# EAGLE design supply (EAGLE 5.01)
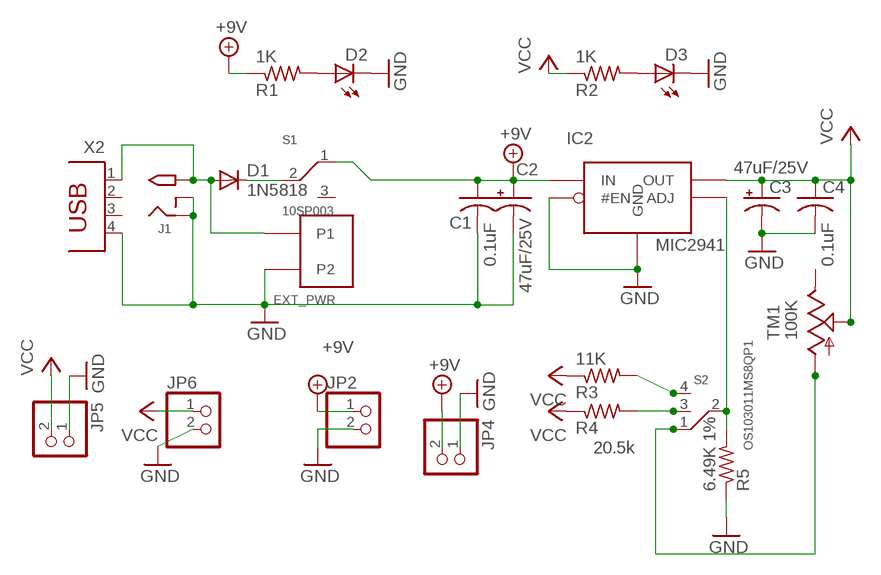
[diagram p0: schematic, sheet 1]

## Parts
C1  0.1uF  C-US025-025X050  [C025-025X050]
C2  47uF/25V  CPOL-USE2.5-6  [E2,5-6]
C3  47uF/25V  CPOL-USE2.5-6  [E2,5-6]
C4  0.1uF  C-US025-025X050  [C025-025X050]
D1  1N5818  1N4004  [DO41-10]
D2  LED3MM  [LED3MM]
D3  LED3MM  [LED3MM]
EXT_PWR  PINHEAD  [TERMBLOCK508]
IC2  MIC2941  [TO220-5]
J1  2.1MMJACK  [PJ-102A]
JP2  PINHD-1X2  [1X02]
JP4  PINHD-1X2  [1X02]
JP5  PINHD-1X2  [1X02]
JP6  PINHD-1X2  [1X02]
R1  1K  R-US_0207/5V  [0207/5V]
R2  1K  R-US_0207/5V  [0207/5V]
R3  11K  R-US_0207/5V  [0207/5V]
R4  20.5k  R-US_0207/5V  [0207/5V]
R5  6.49K 1%  R-US_0207/5V  [0207/5V]
S1  10SP003  [10SP003]
S2  OS103011MS8QP1  [OS103011MS8QP1]
TM1  100K  TRIM  [6MM]
X2  PN61729  [PN61729]

## Nets
+9V: C1.1 C2.+ IC2.4(IN) JP2.1 JP4.2 R1.1 S1.1(T1)
GND: C1.2 C2.- C3.- C4.2 D2.K(C) D3.K(C) EXT_PWR.P$4(P2) IC2.2(#EN) IC2.3(GND) J1.RING J1.RING_SW JP2.2 JP4.1 JP5.1 JP6.2 R5.1 X2.4
N$2: D3.A R2.2
N$3: D1.A EXT_PWR.P$3(P1) J1.TIP X2.1
N$4: R4.2 S2.3(T2)
N$5: R3.2 S2.4(T3)
N$7: IC2.1(ADJ) R5.2 S2.2(P)
N$8: S2.1(T1) TM1.A
N$13: D2.A R1.2
N$17: D1.C S1.2(P)
VCC: C3.+ C4.1 IC2.5(OUT) JP5.2 JP6.1 R2.1 R3.1 R4.1 TM1.S
Unconnected: S1.3(T2) TM1.E X2.2 X2.3

## Library data of the parts
C1 C4 = minimidi:C-US: CAPACITOR, American symbol
C2 C3 = minimidi:CPOL-US: POLARIZED CAPACITOR, American symbol
D1 = minimidi:1N4004: DIODE general purpose rectifier, 1 A
D2 D3 = led-ez:LED: LED OSRAM: - CHIPLED LG R971, LG N971, LY N971, LG Q971, LY Q971, LO R971, LY R971 LH N974, LH R974 LS Q976, LO Q976, LY Q976 LO Q996 - Hyper CHIPLED LW Q18S LB Q993, LB Q99A, LB R99A - SideLED LS A670, LO A670, LY A670, LG A670, LP A670 LB A673, LV A673, LT A673, LW A673 LH A674 LY A675 LS A676, LA A676, LO A676, LY A676, LW A676 LS A679, LY A679, LG A679 - Hyper Micro SIDELED® LS Y876, LA Y876, LO Y876, LY Y876 LT Y87S - SmartLED LW L88C, LW L88S LB L89C, LB L89S, LG L890 LS L89K, LO L89K, LY L89K LS L896, LA L896, LO L896, LY L896 - TOPLED LS T670, LO T670, LY T670, LG T670, LP T670 LSG T670, LSP T670, LSY T670, LOP T670, LYG T670 LG T671, LOG T671, LSG T671 LB T673, LV T673, LT T673, LW T673 LH T674 LS T676, LA T676, LO T676, LY T676, LB T676, LH T676, LSB T676, LW T676 LB T67C, LV T67C, LT T67C, LS T67K, LO T67K, LY T67K, LW E67C LS E67B, LA E67B, LO E67B, LY E67B, LB E67C, LV E67C, LT E67C LW T67C LS T679, LY T679, LG T679 LS T770, LO T770, LY T770, LG T770, LP T770 LB T773, LV T773, LT T773, LW T773 LH T774 LS E675, LA E675, LY E675, LS T675 LS T776, LA T776, LO T776, LY T776, LB T776 LHGB T686 LT T68C, LB T68C - Hyper Mini TOPLED® LB M676 - Mini TOPLED Santana® LG M470 LS M47K, LO M47K, LY M47K Source: http://www.osram.convergy.de/
EXT_PWR = mshield:PINHEAD
IC2 = bbsup:MIC2941
J1 = minimidi:2.1MMJACK
JP2 JP4-JP6 = pinhead:PINHD-1X2: PIN HEADER
R1-R5 = rcl-ez:R-US_: RESISTOR, American symbol
S1 = bbsup:10SP003
S2 = bbsup:OS103011MS8QP1
TM1 = bbsup:TRIM
X2 = con-berg-ez:PN61729: BERG USB connector

## Net classes
1 power: width 0.61 mm

## Board
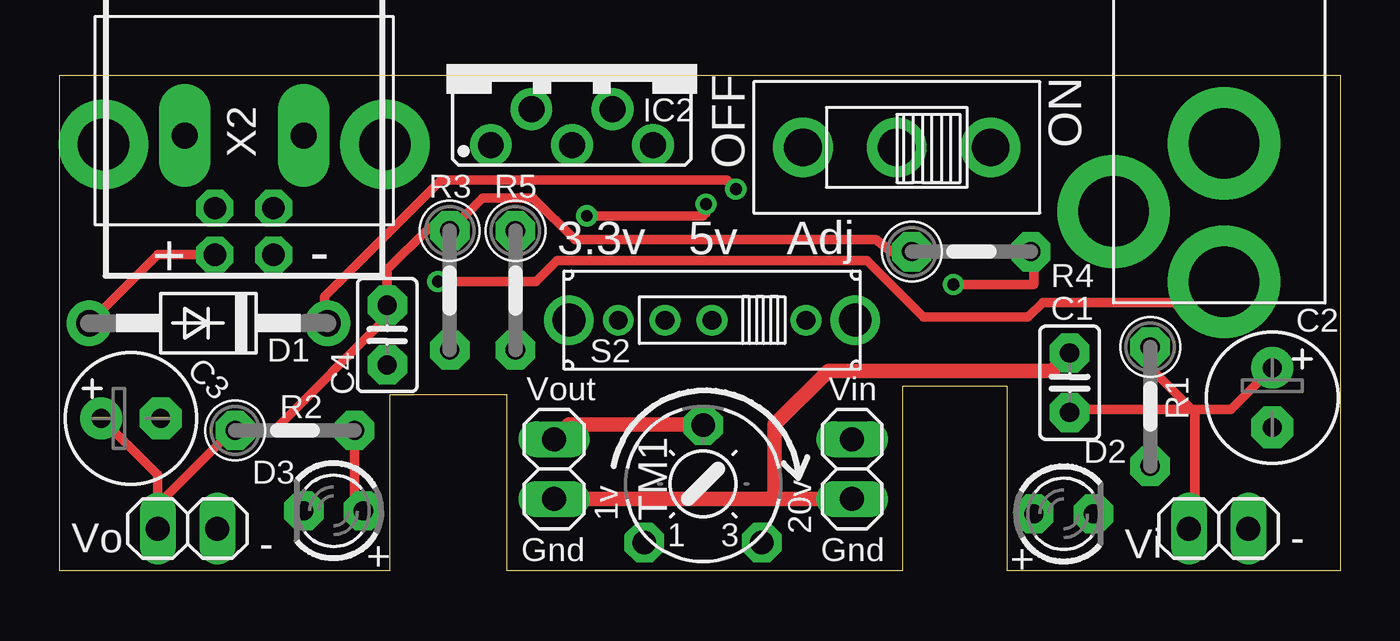
[diagram p1: board, top side]
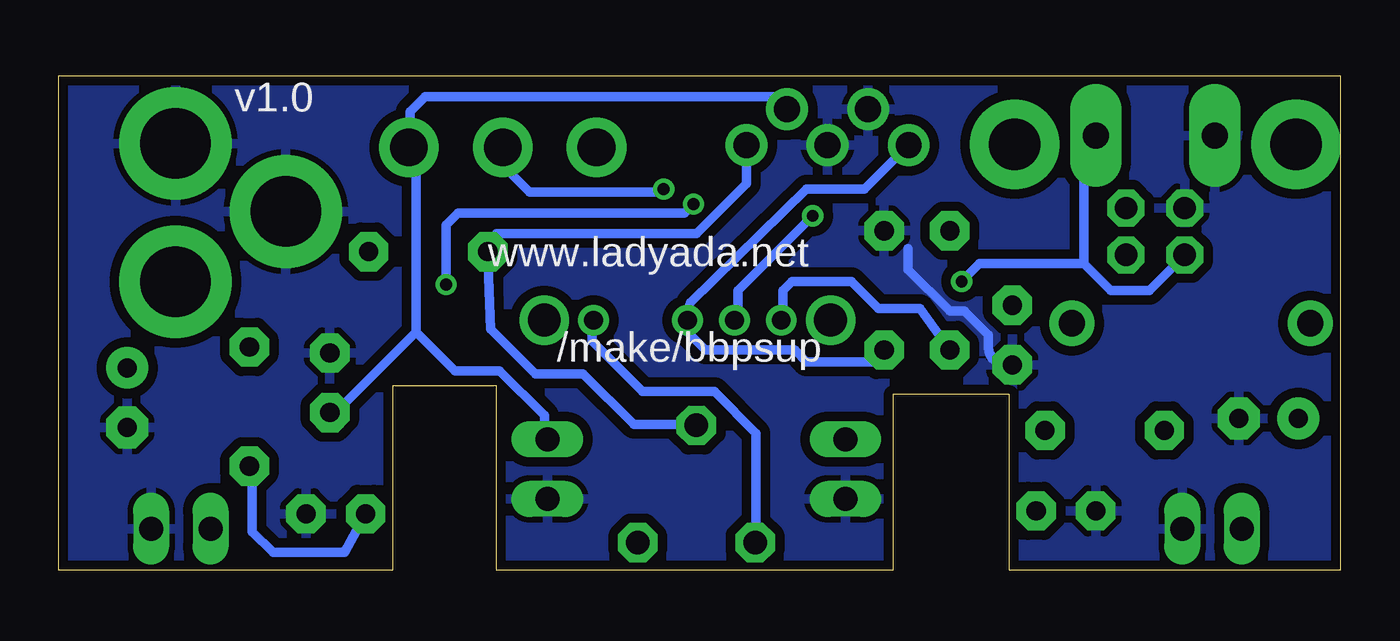
[diagram p2: board, bottom side, seen from below]

Size 54.61 x 21.08 mm. Coordinates in mm from the lower left corner, seen from the top.
Outline: 0,0 14.1,0 14.1,7.49 19.05,7.49 19.05,0 35.94,0 35.94,7.87 40.39,7.87 40.39,0 54.61,0 54.61,21.08 0,21.08 0,0
Copper layers (1*16): Top 0.035mm / dielectric 1.5mm / Bottom 0.035mm
Design rules "default": minimum track width 10mil, minimum drill 19mil, track to track 12mil, track to pad 12mil, pad to pad 12mil, via to via 12mil, smd to smd 0mil, copper to edge 10mil, drill to drill 8mil, minimum pad ring 10mil, minimum via ring 8mil, stop-mask expansion 4mil, vias tented up to drill 20mil, thermal gap 10mil

### Footprints (pad centres in the part's own frame; a part is rotated, then mirrored left to right if it is on the bottom)
C025-025X050 = drill 0.813 pad 1.676 octagon: 1 -1.27,0; 2 1.27,0
E2,5-6 = drill 0.813 pad 1.778 round: + -1.27,0 | drill 0.813 pad 1.778 octagon: - 1.27,0
DO41-10 = drill 1.118 pad 1.93 round: A 5.08,0; C -5.08,0
LED3MM = drill 0.813 pad 1.676 octagon: A -1.27,0; K 1.27,0
TERMBLOCK508 = drill 1.1 pad 2.184 long: P$3 -2.54,0; P$4 2.54,0
TO220-5 = drill 1.1 pad 1.778 round: 1 -3.454,-3.454; 2 -1.727,-1.93; 3 0,-3.454; 4 1.727,-1.93; 5 3.454,-3.454
PJ-102A = drill 3 pad 4.8 round: RING 0.1,-3.39; RING_SW -4.6,-6.29; TIP 0.1,-9.29
1X02 = drill 1.016 long: 1 -1.27,0; 2 1.27,0
0207/5V = drill 0.813 pad 1.676 octagon: 1 -2.54,0; 2 2.54,0
10SP003 = drill 1.6 pad 2.54 round: 1 -4,0; 2 0,0; 3 4,0
OS103011MS8QP1 = drill 0.8 round: 1 -4,0; 2 0,0; 3 2,0; 4 4,0 | drill 1.4 round: MT1 -6.1,0; MT2 6.1,0
6MM = drill 1 pad 1.676 octagon: A -2.5,-2.5; E 2.5,-2.5; S 0,2.5
PN61729 = drill 0.95 pad 1.575 octagon: 1 1.25,4.71; 2 -1.25,4.71; 3 -1.25,2.71; 4 1.25,2.71 | drill 2.2 pad 3.81 round: P$1 -6,0; P$2 6,0

### Placement (x,y rotation side)
C1  43.05,8 90 top
C2  51.69,7.37 270 top
C3  3.05,6.48 0 top
C4  13.97,10.03 270 top
D1  6.35,10.54 180 top
D2  42.8,2.41 0 top
D3  11.68,2.54 180 top
EXT_PWR  7.87,18.54 180 top
IC2  21.84,21.59 0 top
J1  49.53,21.59 0 top
JP2  33.78,4.32 270 top
JP4  49.4,1.78 180 top
JP5  5.46,1.78 180 top
JP6  21.08,4.32 270 top
R1  46.48,6.99 270 top
R2  10.03,5.97 0 top
R3  16.64,11.94 270 top
R4  38.86,13.59 0 top
R5  19.43,11.94 270 top
S1  35.69,18.03 180 top
S2  27.81,10.67 180 top
TM1  27.43,3.68 0 top
X2  7.87,18.16 180 top

### Tracks (layer width: path | path; a pad name or v marks a point on that pad's centre or on a via)
+9V
  Top 0.406: JP4.2 48.39,2.03 48.39,6.73 48.32,6.79 | 48.32,6.79 46.48,8.64 R1.1 | 48.39,6.86 48.32,6.79 | C2.+ 49.91,6.86 48.39,6.86 | C1.1 43.18,6.86 48.39,6.86
  Bottom 0.406: C2.+ 51.69,8.76 | IC2.4 24.11,20.19 38.99,20.19 39.62,19.56 39.62,18.1 S1.1 39.56,18.16 39.37,18.16 39.37,10.16 | C1.1 42.93,6.6 39.37,10.16 | 39.37,10.16 37.72,8.51 35.81,8.51 33.91,6.6 33.91,5.46 | 33.91,5.46 33.91,5.33 | JP2.1 33.91,5.46
GND
  Top 0.61: 33.91,3.05 JP2.2 30.48,3.05 | JP6.2 30.48,3.05 | C1.2 42.29,8.51 32.77,8.51 30.48,6.22 30.48,3.05
  Bottom 0.406: C4.2 14.22,8.76 arc90 14.99,9.53 14.99,10.03 16,11.05 16.64,11.05 18.41,12.83 18.41,13.72 | R5.1 19.43,14.73
  pour Bottom (isolate 0.406): 0,21.08 0,0 54.48,0 54.48,21.08
N$2
  Top 0.406: 12.57,6.1 R2.2 12.57,2.92 D3.A
N$3  (via drill 0.5)
  Top 0.406: J1.TIP 48.12,10.79 47.49,11.43 41.91,11.43 41.27,10.79 36.83,10.79 34.42,13.21 21.21,13.21 20.32,12.32 v16.13,12.32 | X2.1 6.61,13.46 4.19,13.46 D1.A
  Bottom 0.406: X2.1 8.14,11.94 9.78,11.94 10.92,13.08 | EXT_PWR.P$3 10.54,18.54 10.92,18.16 10.92,13.08 | v16.13,12.32 15.37,13.08 10.92,13.08
N$4  (via drill 0.5)
  Top 0.406: v22.48,15.11 27.43,15.11 27.56,15.24 v27.56,15.62 | v38.1,12.19 41.53,12.19 41.53,13.59 R4.2
  Bottom 0.406: S2.3 25.65,10.67 25.65,11.94 v22.48,15.11 | v27.56,15.62 27.94,15.24 37.59,15.24 38.1,14.73 v38.1,12.19
N$5
  Bottom 0.406: 23.75,10.67 S2.4 23.75,10.73 23.75,11.94 23.37,12.32 20.83,12.32 19.68,11.18 17.91,11.18 R3.2
N$7
  Bottom 0.406: S2.2 27.94,10.79 27.69,11.43 22.73,16.26 20.27,16.26 IC2.1 | S2.2 27.94,10.67 | S2.2 27.81,10.16 27.05,9.4 23.24,9.4 22.73,8.89 19.56,8.89 19.43,9.02 R5.2 19.43,9.53
N$8
  Bottom 0.406: 24.98,1.18 25.02,1.14 | TM1.A 24.98,1.18 | 24.98,1.18 24.89,1.27 24.89,5.84 26.67,7.62 29.72,7.62 31.88,9.78 31.88,10.67 S2.1
N$13
  Bottom 0.406: D2.A 42.42,0.76 45.47,0.76 46.35,1.65 46.35,4.57 R1.2
N$17  (via drill 0.5)
  Top 0.406: D1.C 11.3,10.41 11.3,11.68 16.26,16.64 28.45,16.64 v28.83,16.26
  Bottom 0.406: v28.83,16.26 28.96,16.13 34.54,16.13 35.69,17.27 S1.2
VCC
  Top 0.406: 36.58,13.59 R4.1 35.43,13.59 34.8,14.1 21.97,14.1 20.19,15.88 18.03,15.88 R3.1 15.75,14.61 13.97,12.83 C4.1 | C4.1 13.97,11.18 | C4.1 13.97,10.79 9.14,5.97 R2.1 7.37,5.97 4.19,2.79 JP5.2 4.19,4.06 C3.+
  Top 0.61: TM1.S 27.39,6.22 21.72,6.22 JP6.1
  Bottom 0.406: 27.43,6.22 27.3,6.35 | IC2.5 25.3,16.48 27.43,14.35 35.94,14.35 36.58,13.72 36.45,13.59 R4.1 36.2,10.29 34.29,8.38 32.26,8.38 30.1,6.22 27.43,6.22 | 27.43,6.22 TM1.S

### Text on the board
tPlace: ON | OFF | + | - | 3.3v | 5v | Adj | Vout | Vin | 20v | 1v | Vi | Vo | - | Gnd | - | + | Gnd | +
bPlace: v1.0 | www.ladyada.net | /make/bbpsup